# Altium schematic sheet communication.SchDoc: Connector Page
size A4; DrawnBy: Rémi St-Onge; Revision: 1
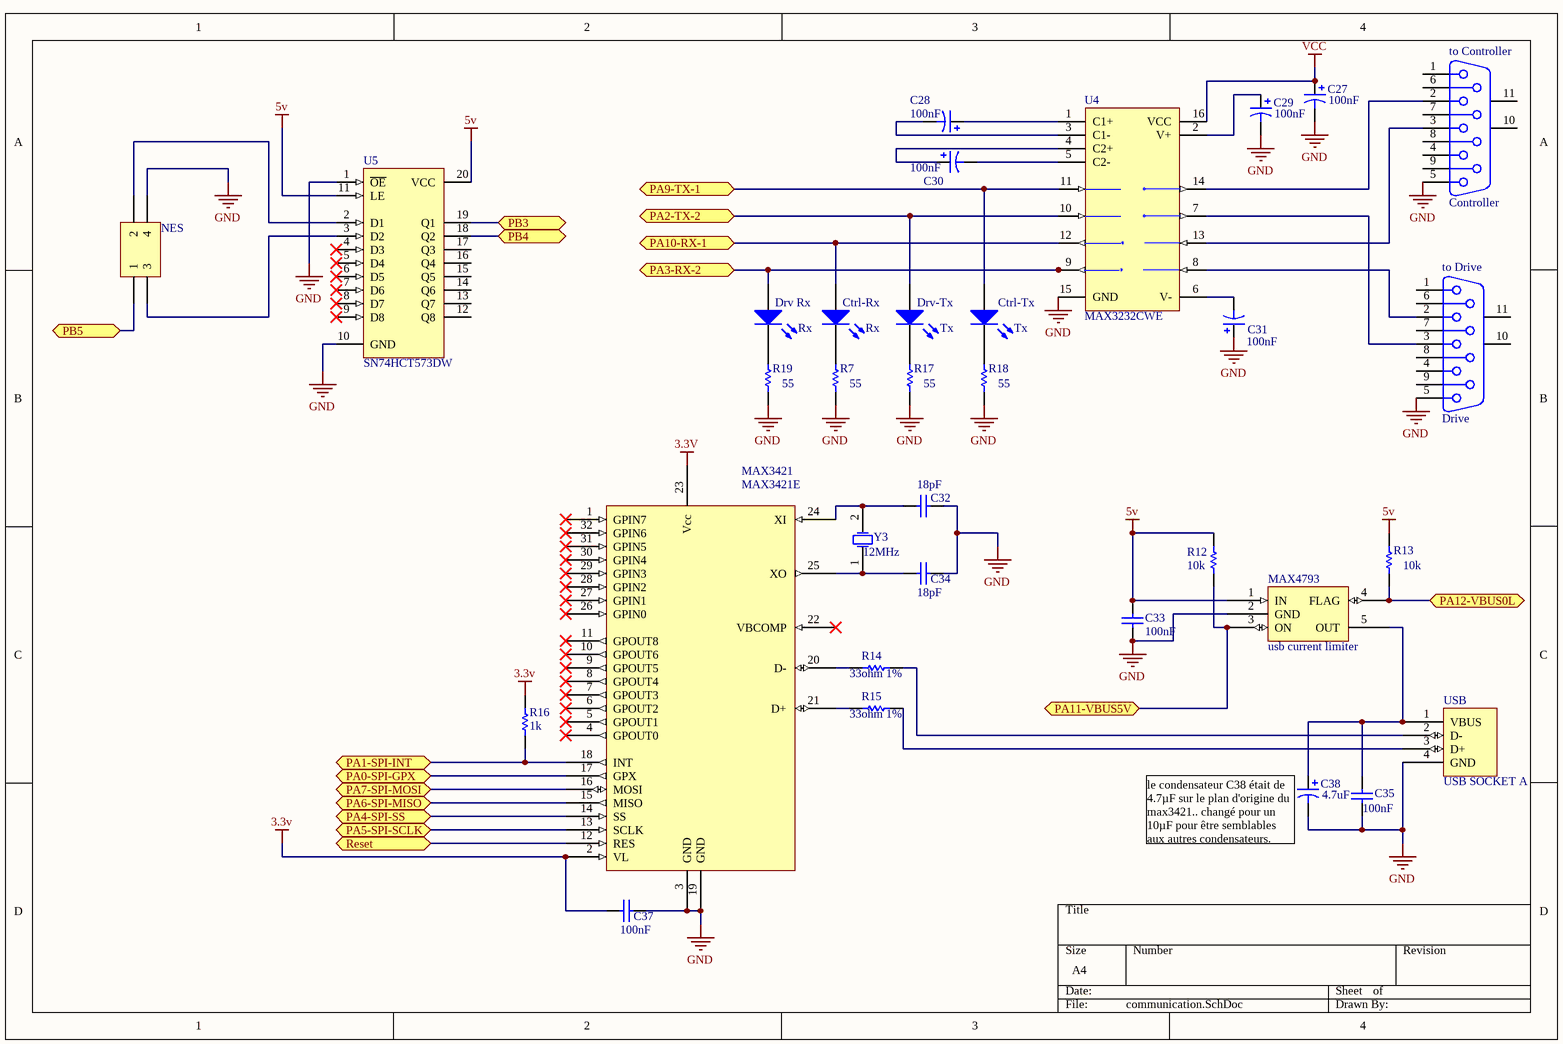
[diagram p0: communication.SchDoc]

## Parts
C27  value 100nF  [CAPC3216M]  (hidden comment: Cap Pol3)
C28  value 100nF  [CAPC3216M]  (hidden comment: Cap Pol3)
C29  value 100nF  [CAPC3216M]  (hidden comment: Cap Pol3)
C30  value 100nF  [CAPC3216M]  (hidden comment: Cap Pol3)
C31  value 100nF  [CAPC3216M]  (hidden comment: Cap Pol3)
C32  value 18pF  [CAPC1608L]  (hidden comment: Cap)
C33  value 100nF  [CAPC1608L]  (hidden comment: Cap)
C34  value 18pF  [CAPC1608L]  (hidden comment: Cap)
C35  value 100nF  [CAPC1608L]  (hidden comment: Cap)
C37  value 100nF  [CAPC1608L]  (hidden comment: Cap)
C38  value 4.7uF  [CAPC3216M]  (hidden comment: Cap Pol3)
Ctrl-Rx  Rx  [3.2X1.6X1.1]
Ctrl-Tx  Tx  [3.2X1.6X1.1]
Drv-Tx  Tx  [3.2X1.6X1.1]
Drv_Rx  Rx  [3.2X1.6X1.1]
MAX3421  MAX3421E  [TQFP32_L]
MAX4793  usb current limiter  [SOT95P280X145-5N]
NES  NES  [NES connector]  (value not drawn)
R7  value 55  [RESC1608L]  (hidden comment: Res1)
R12  value 10k  [RESC1608L]  (hidden comment: Res1)
R13  value 10k  [RESC1608L]  (hidden comment: Res1)
R14  value 33ohm 1%  [RESC1608L]  (hidden comment: Res1)
R15  value 33ohm 1%  [RESC1608L]  (hidden comment: Res1)
R16  value 1k  [RESC1608L]  (hidden comment: Res1)
R17  value 55  [RESC1608L]  (hidden comment: Res1)
R18  value 55  [RESC1608L]  (hidden comment: Res1)
R19  value 55  [RESC1608L]  (hidden comment: Res1)
to_Controller  Controller  [DSUB1.385-2H9]
to_Drive  Drive  [DSUB1.385-2H9]
U4  MAX3232CWE  [WSO16_N]
U5  SN74HCT573DW  [DW020_N]
USB  USB SOCKET A  [USB2.5-2H4B]
Y3  12MHz  [HC-49U]

## Ports
PA0-SPI-GPX, PA1-SPI-INT, PA2-TX-2 (bidir), PA3-RX-2 (bidir), PA4-SPI-SS, PA5-SPI-SCLK, PA6-SPI-MISO, PA7-SPI-MOSI, PA9-TX-1, PA10-RX-1 (bidir), PA11-VBUS5V, PA12-VBUS0L (bidir), PB3 (bidir), PB4 (bidir), PB5, Reset

## Nets
3.3V: C37.1 MAX3421.2(VL) MAX3421.23(Vcc) R16.2
5v: C33.2 MAX4793.1(IN) R12.2 R13.2 U5.11(LE) U5.20(VCC)
GND: C27.2 C29.2 C31.1 C32.2 C33.1 C34.2 C35.1 C37.2 C38.2 MAX3421.3(GND) MAX3421.19(GND) MAX4793.2(GND) NES.4 R7.1 R17.1 R18.1 R19.1 to_Controller.5 to_Drive.5 U4.15(GND) U5.1(~{OE}) U5.10(GND) USB.4(GND)
VCC: C27.1 U4.16(VCC)
PA0-SPI-GPX: MAX3421.17(GPX) ; port PA0-SPI-GPX
PA1-SPI-INT: MAX3421.18(INT) R16.1 ; port PA1-SPI-INT
PA2-TX-2: Drv-Tx.1(A) U4.10(T2IN) ; port PA2-TX-2
PA3-RX-2: Drv_Rx.1(A) U4.9(R2OUT) ; port PA3-RX-2
PA4-SPI-SS: MAX3421.14(SS) ; port PA4-SPI-SS
PA5-SPI-SCLK: MAX3421.13(SCLK) ; port PA5-SPI-SCLK
PA6-SPI-MISO: MAX3421.15(MISO) ; port PA6-SPI-MISO
PA7-SPI-MOSI: MAX3421.16(MOSI) ; port PA7-SPI-MOSI
PA9-TX-1: Ctrl-Tx.1(A) U4.11(T1IN) ; port PA9-TX-1
PA10-RX-1: Ctrl-Rx.1(A) U4.12(R1OUT) ; port PA10-RX-1
PA11-VBUS5V: MAX4793.3(ON) R12.1 ; port PA11-VBUS5V
PA12-VBUS0L: MAX4793.4(FLAG) R13.1 ; port PA12-VBUS0L
PB3: U5.19(Q1) ; port PB3
PB4: U5.18(Q2) ; port PB4
PB5: NES.1 ; port PB5
Reset: MAX3421.12(RES) ; port Reset
NetC28_1: C28.1 U4.1(C1+)
NetC28_2: C28.2 U4.3(C1-)
NetC29_1: C29.1 U4.2(V+)
NetC30_1: C30.1 U4.4(C2+)
NetC30_2: C30.2 U4.5(C2-)
NetC31_2: C31.2 U4.6(V-)
NetC32_1: C32.1 MAX3421.24(XI) Y3.2(OSC2)
NetC34_1: C34.1 MAX3421.25(XO) Y3.1(OSC1)
NetC35_2: C35.2 C38.1 MAX4793.5(OUT) USB.1(VBUS)
NetCtrl-Rx_2: Ctrl-Rx.2(K) R7.2
NetCtrl-Tx_2: Ctrl-Tx.2(K) R18.2
NetDrv-Tx_2: Drv-Tx.2(K) R17.2
NetDrv_Rx_2: Drv_Rx.2(K) R19.2
NetMAX3421_20: MAX3421.20(D-) R14.1
NetMAX3421_21: MAX3421.21(D+) R15.1
NetNES_2: NES.2 U5.2(D1)
NetNES_3: NES.3 U5.3(D2)
NetR14_2: R14.2 USB.2(D-)
NetR15_2: R15.2 USB.3(D+)
Netto_Controller_2: to_Controller.2 U4.14(T1OUT)
Netto_Controller_3: to_Controller.3 U4.13(R1IN)
Netto_Drive_2: to_Drive.2 U4.8(R2IN)
Netto_Drive_3: to_Drive.3 U4.7(T2OUT)

Not connected (* = marked no-connect by the designer): MAX3421 1(GPIN7)* 4(GPOUT0)* 5(GPOUT1)* 6(GPOUT2)* 7(GPOUT3)* 8(GPOUT4)* 9(GPOUT5)* 10(GPOUT6)* 11(GPOUT8)* 22(VBCOMP)* 26(GPIN0)* 27(GPIN1)* 28(GPIN2)* 29(GPIN3)* 30(GPIN4)* 31(GPIN5)* 32(GPIN6)*; to_Controller 1 4 6 7 8 9 10(MH1) 11(MH2); to_Drive 1 4 6 7 8 9 10(MH1) 11(MH2); U5 4(D3)* 5(D4)* 6(D5)* 7(D6)* 8(D7)* 9(D8)* 12(Q8) 13(Q7) 14(Q6) 15(Q5) 16(Q4) 17(Q3)

## Notes on the sheet
- (near C38) le condensateur C38 était de 4.7µF sur le plan d'origine du max3421.. changé pour un 10µF pour être semblables aux autres condensateurs.

## Library data of the parts
C27-C31 C38 = Cap Pol3: Polarized Capacitor (Surface Mount); Published: 8-Jun-2000; LatestRevisionDate: 29-May-2009; LatestRevisionNote: IPC-7351 Footprint Added.; PackageReference: C0805; Publisher: Altium Limited; PackageDescription: Chip Capacitor
C32-C35 C37 = Cap: Capacitor; Published: 8-Jun-2000; LatestRevisionDate: 17-Jul-2002; LatestRevisionNote: Re-released for DXP Platform.; PackageReference: RAD-0.3; Publisher: Altium Limited
Ctrl-Rx Ctrl-Tx Drv-Tx Drv_Rx = LED2: Typical RED, GREEN, YELLOW, AMBER GaAs LED; Published: 8-Jun-2000; LatestRevisionDate: 17-Jul-2002; LatestRevisionNote: Re-released for DXP Platform.; PackageVersion: Feb-2002; PackageReference: 3.2X1.6X1.1; Publisher: Altium Limited
MAX4793 = MAX4793: Published: 24-Mar-1999; LatestRevisionDate: 17-Dec-2003; LatestRevisionNote: Schematic revised, PCB Footprint replaced.; PackageReference: ABSM-1574; Publisher: Altium Limited; ComponentLink1Description: Manufacturer Link; ComponentLink1URL: http://www.megastar.com/linecard/buzzmode/index.php
NES = Header 2X2: Header, 2-Pin, Dual row; LatestRevisionDate: 17-Jul-2002; LatestRevisionNote: Re-released for DXP Platform.; Publisher: Altium Limited
R7 R12-R19 = Res1: Resistor; Published: 8-Jun-2000; LatestRevisionDate: 17-Jul-2002; LatestRevisionNote: Re-released for DXP Platform.; PackageReference: AXIAL-0.3; Publisher: Altium Limited
to_Controller to_Drive = D Connector 9: Receptacle Assembly, 9 Position, Right Angle; PackageDocument: O; Positions: 9; Published: 15-Jun-2001; LatestRevisionDate: 17-Jul-2002; LatestRevisionNote: Re-released for DXP Platform.; DatasheetDocument: 1-Sep-1999; PackageReference: 788750; Publisher: Altium Limited; Orientation: Right Angle; Gender: Receptacle
U4 = MAX3232CWE: 3.0V TO 5.5V, Low-Power, up to 1Mbps, True RS-232 Transceiver Using Four 0.1µF External Capacitor; Published: 16-Jan-2001; LatestRevisionDate: 13-Apr-2006; LatestRevisionNote: IPC-7351 Footprint Added.; DatasheetVersion: Mar-1999; PackageReference: WSO16; Publisher: Altium Limited; PackageDescription: 16-Pin Small Outline Integrated Circuit 1.27 mm Pitch; Code_JEDEC: MS-013-AA; Code_IPC: SOIC127P1030-16; ComponentLink1Description: Manufacturer Link; ComponentLink1URL: http://www.maxim-ic.com/; ComponentLink2Description: Datasheet; ComponentLink2URL: http://pdfserv.maxim-ic.com/en/ds/MAX3222-MAX3241.pdf
U5 = SN74HCT573DW: Octal Transparent D-Type Latch with 3-State Outputs; Published: 8-Jun-2000; LatestRevisionDate: 13-Apr-2006; LatestRevisionNote: IPC-7351 Footprint Added.; DatasheetVersion: Feb-1998; PackageVersion: Mar-2000; PackageReference: DW020; Publisher: Altium Limited; PackageDescription: 20-Pin Plastic Small Outline Integrated Circuit 1.27 mm Pitch; Code_JEDEC: MS-013; Code_IPC: SOIC127P1030-20; ComponentLink1Description: Manufacturer Link; ComponentLink1URL: http://www.ti.com/; ComponentLink2Description: Datasheet; ComponentLink2URL: http://www-s.ti.com/sc/ds/sn74hct573.pdf
Y3 = XTAL: Crystal Oscillator; Published: 8-Jun-2000; LatestRevisionDate: 17-Jul-2002; LatestRevisionNote: Re-released for DXP Platform.; PackageReference: R38; Publisher: Altium Limited
USB = USB SOCKET A: Published: 24-Mar-1999; LatestRevisionDate: 17-Dec-2003; LatestRevisionNote: Schematic revised, PCB Footprint replaced.; PackageReference: ABSM-1574; Publisher: Altium Limited; ComponentLink1Description: Manufacturer Link; ComponentLink1URL: http://www.megastar.com/linecard/buzzmode/index.php